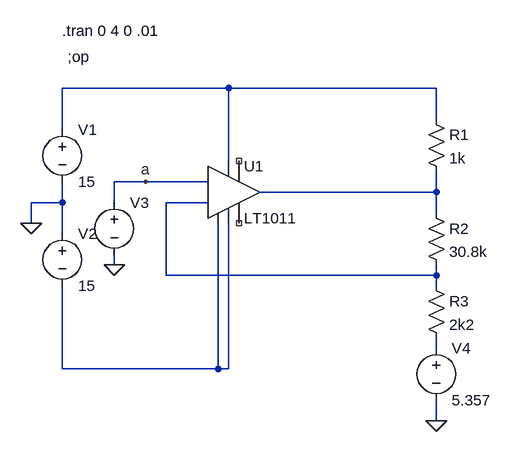
[diagram p0: schematic comparadorLt1011_6.asc]
comparadorLt1011_6.asc, the LTspice schematic file:
Version 4
SHEET 1 1044 680
WIRE 192 0 -64 0
WIRE 512 0 192 0
WIRE 512 48 512 0
WIRE -64 64 -64 0
WIRE 192 112 192 0
WIRE 64 144 16 144
WIRE 160 144 64 144
WIRE 512 160 512 128
WIRE 512 160 240 160
WIRE -64 176 -64 144
WIRE -64 176 -112 176
WIRE 16 176 16 144
WIRE 160 176 96 176
WIRE 512 192 512 160
WIRE -112 208 -112 176
WIRE -64 224 -64 176
WIRE 16 272 16 256
WIRE 96 288 96 176
WIRE 512 288 512 272
WIRE 512 288 96 288
WIRE 512 304 512 288
WIRE 512 400 512 384
WIRE -64 432 -64 304
WIRE 176 432 176 208
WIRE 176 432 -64 432
WIRE 192 432 192 208
WIRE 192 432 176 432
WIRE 512 512 512 480
FLAG -112 208 0
FLAG 16 272 0
FLAG 64 144 a
FLAG 512 512 0
DATAFLAG 464 160 ""
SYMBOL Comparators\\LT1011 192 160 R0
SYMATTR InstName U1
SYMBOL voltage -64 48 R0
WINDOW 123 0 0 Left 0
WINDOW 39 0 0 Left 0
SYMATTR InstName V1
SYMATTR Value 15
SYMBOL voltage -64 208 R0
WINDOW 123 0 0 Left 0
WINDOW 39 0 0 Left 0
SYMATTR InstName V2
SYMATTR Value 15
SYMBOL res 496 32 R0
SYMATTR InstName R1
SYMATTR Value 1k
SYMBOL res 496 176 R0
SYMATTR InstName R2
SYMATTR Value 30.8k
SYMBOL res 496 288 R0
SYMATTR InstName R3
SYMATTR Value 2k2
SYMBOL voltage 16 160 R0
WINDOW 3 24 96 Invisible 2
WINDOW 123 0 0 Left 0
WINDOW 39 0 0 Left 0
SYMATTR Value PWL(0 0 1 14 3 -14 4 0)
SYMATTR InstName V3
SYMBOL voltage 512 384 R0
WINDOW 123 0 0 Left 0
WINDOW 39 0 0 Left 0
SYMATTR InstName V4
SYMATTR Value 5.357
TEXT -56 -48 Left 2 !;op
TEXT -64 -88 Left 2 !.tran 0 4 0 .01

The netlist it stands for:
* comparadorLt1011_6.asc
XU1 N005 N003 a N005 NC_01 NC_02 N002 N001 LT1011
V1 N001 0 15
V2 0 N005 15
R1 N001 N002 1k
R2 N002 N003 30.8k
R3 N003 N004 2k2
V3 a 0 PWL(0 0 1 14 3 -14 4 0)
V4 N004 0 5.357
;op
.tran 0 4 0 .01
.lib LTC1.lib
.backanno
.end